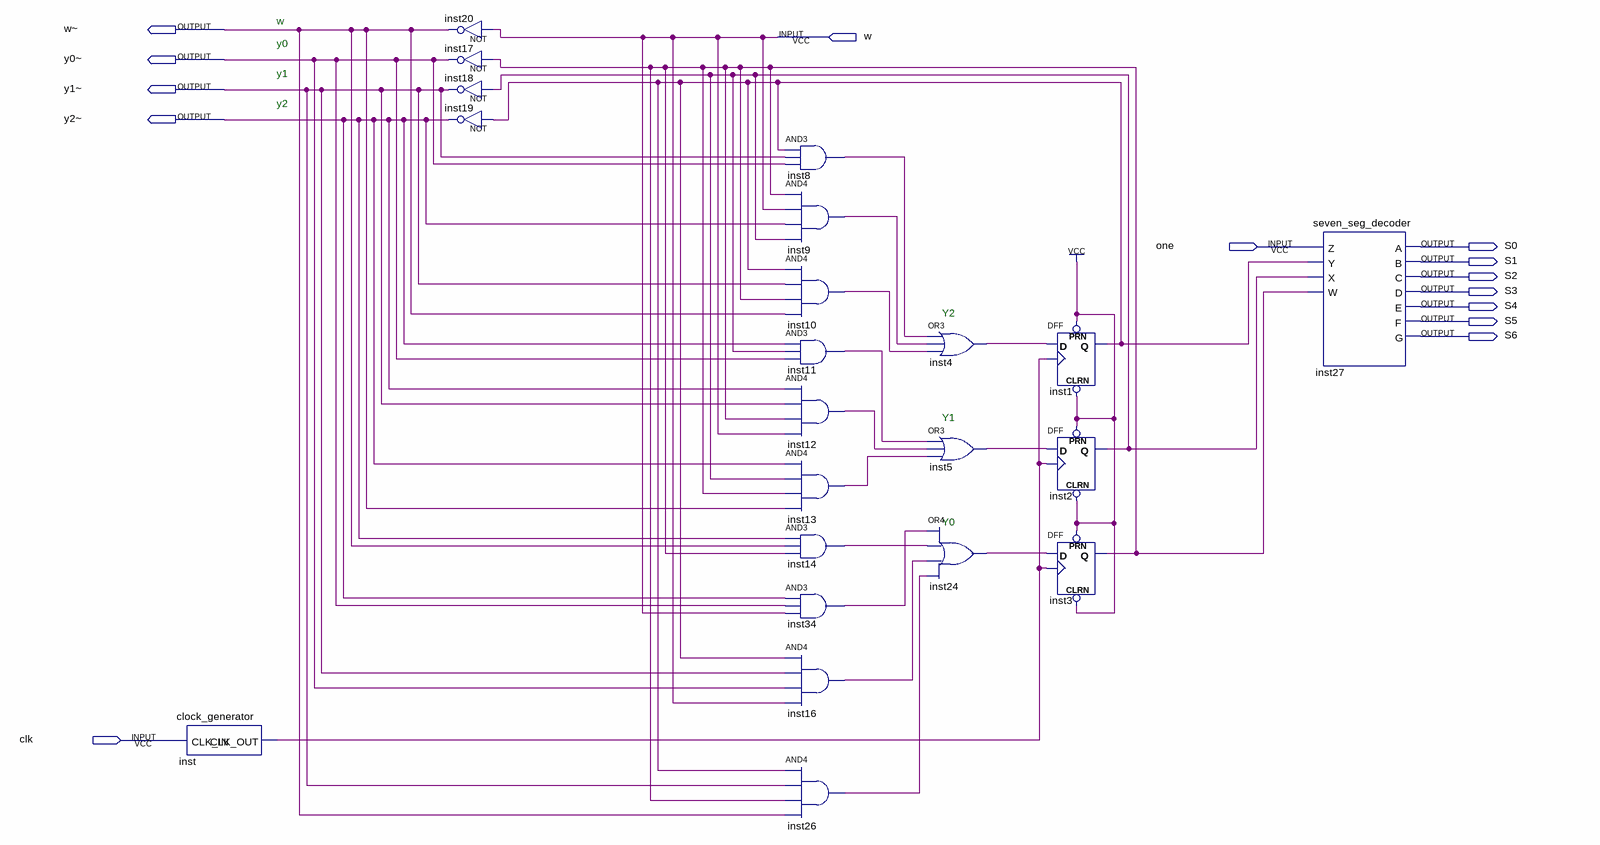
[diagram p0: schematic sheet]
// Quartus schematic lab11step1.bdf as structural Verilog: 22 symbols, 14 pins
module lab11step1 (
  input  w,
  input  one,
  input  clk,
  output \w~ ,
  output \y0~ ,
  output \y1~ ,
  output \y2~ ,
  output S0,
  output S1,
  output S2,
  output S3,
  output S4,
  output S5,
  output S6
);

  wire inst1_q, inst2_q, inst3_q, inst4_out, inst5_out, inst8_out, inst9_out, inst10_out, inst11_out,
       inst12_out, inst13_out, inst14_out, inst16_out, inst24_out, inst26_out, inst34_out, inst_clk_out;

  clock_generator inst (.CLK_IN(clk), .CLK_OUT(inst_clk_out));
  not inst20 (\w~ , w);
  not inst17 (\y0~ , inst3_q);
  not inst18 (\y1~ , inst2_q);
  not inst19 (\y2~ , inst1_q);
  and inst8 (inst8_out, inst1_q, \y1~ , \y0~ );
  and inst9 (inst9_out, inst3_q, w, \y2~ , inst2_q);
  and inst10 (inst10_out, inst1_q, \y1~ , inst3_q, \w~ );
  and inst11 (inst11_out, \y2~ , inst2_q, \y0~ );
  and inst12 (inst12_out, \y2~ , \y1~ , inst3_q, w);
  and inst13 (inst13_out, \y2~ , inst2_q, inst3_q, \w~ );
  and inst14 (inst14_out, \y2~ , \w~ , inst3_q);
  and inst34 (inst34_out, \y2~ , \y0~ , w);
  and inst16 (inst16_out, inst1_q, \y1~ , \y0~ , w);
  and inst26 (inst26_out, inst1_q, \y1~ , inst3_q, \w~ );
  or inst4 (inst4_out, inst8_out, inst9_out, inst10_out);
  or inst5 (inst5_out, inst11_out, inst12_out, inst13_out);
  or inst24 (inst24_out, inst34_out, inst14_out, inst16_out, inst26_out);
  DFF inst1 (.CLRN(1'b1), .CLK(inst_clk_out), .D(inst4_out), .PRN(1'b1), .Q(inst1_q));
  DFF inst2 (.CLRN(1'b1), .CLK(inst_clk_out), .D(inst5_out), .PRN(1'b1), .Q(inst2_q));
  DFF inst3 (.CLRN(1'b1), .CLK(inst_clk_out), .D(inst24_out), .PRN(1'b1), .Q(inst3_q));
  seven_seg_decoder inst27 (
    .Z(one), .Y(inst1_q), .X(inst2_q), .W(inst3_q), .A(S0), .B(S1), .C(S2), .D(S3), .E(S4), .F(S5), .G(S6));

  // Notes on the sheet:
  //   w
  //   y0
  //   y1
  //   y2
  //   Y2
  //   Y1
  //   Y0
endmodule
